# Altium schematic sheet PSU.SchDoc
size A; Author: duchuylee; DrawnBy: Duc Huy Le; SheetNumber: 2; SheetTotal: 4
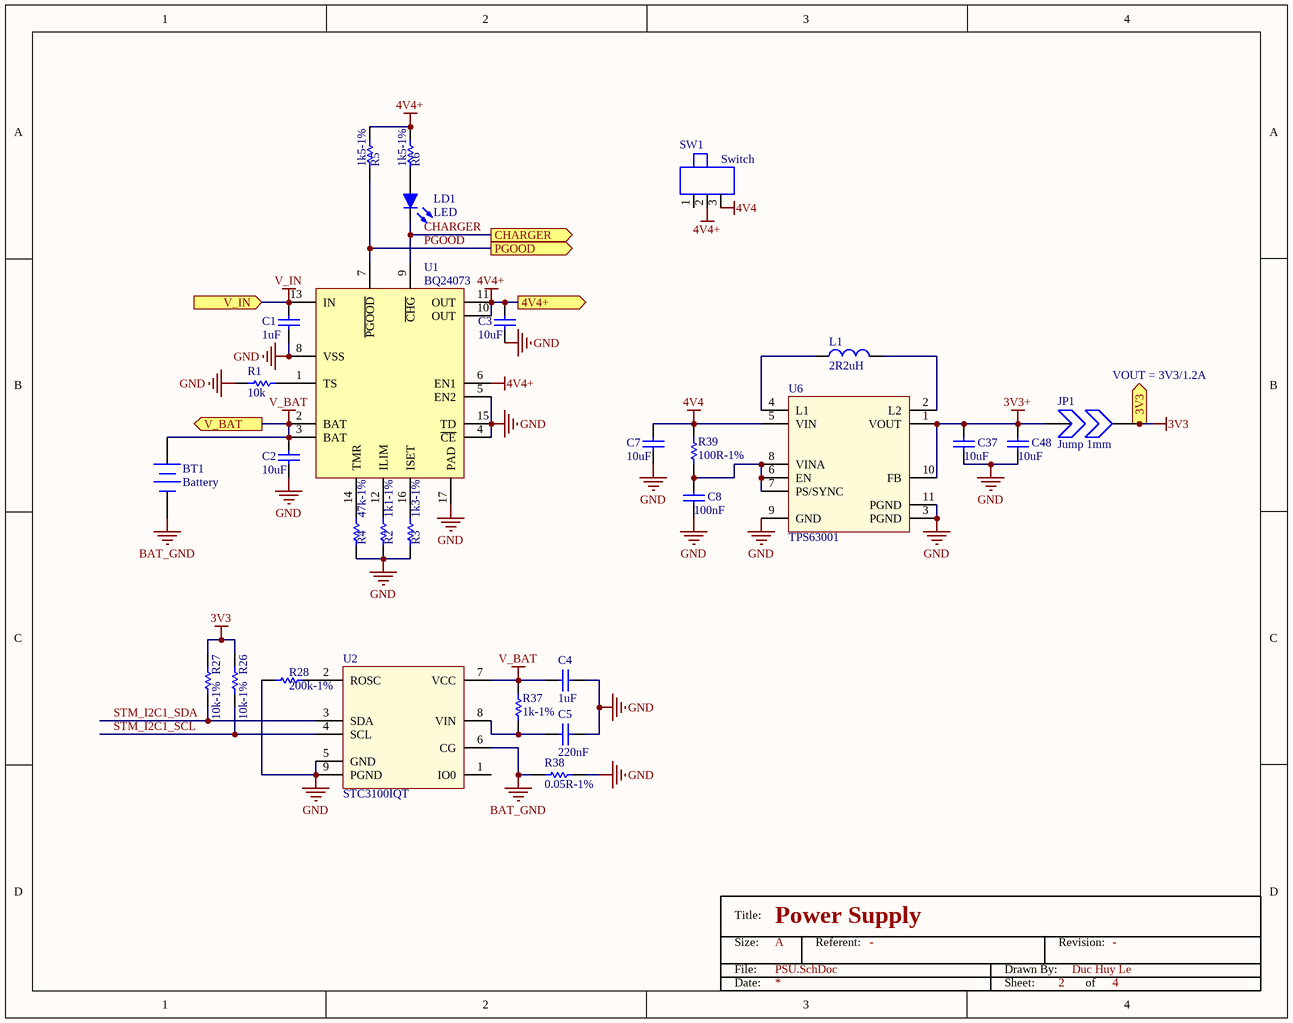
[diagram p0: PSU.SchDoc]

## Parts
BT1  Battery  [BAT-2]
C1  1uF  [Cap 0603]
C2  10uF  [Cap 0603]
C3  10uF  [Cap 0603]
C4  1uF  [Cap 0603]
C5  220nF  [Cap 0603]
C7  10uF  [Cap 0603]
C8  100nF  [Cap 0603]
C37  10uF  [Cap 0603]
C48  10uF  [Cap 0603]
JP1  Jump 1mm  [Jump 1mm]
L1  2R2uH  [Inductor 0520]
LD1  LED  [LED]
R1  10k  [Res 0603]
R2  1k1-1%  [Res 0603]
R3  1k3-1%  [Res 0603]
R4  47k-1%  [Res 0603]
R5  1k5-1%  [Res 0603]
R6  1k5-1%  [Res 0603]
R26  10k-1%  [Res 0603]
R27  10k-1%  [Res 0603]
R28  200k-1%  [Res 0603]
R37  1k-1%  [Res 0603]
R38  0.05R-1%  [Res 2512]
R39  100R-1%  [Res 0603]
SW1  Switch  [Slide switch MSK-38]
TitleBlock2  Title: Power Supply  Size: A  (hidden comment: Title Block)
U1  BQ24073  [QFN-16]
U2  STC3100IQT  [DFN-8 3x3]
U6  TPS63001  [VSON-10 3x3]

## Ports
3V3 (out), 4V4+ (out), CHARGER (out), PGOOD (out), V_BAT (out), V_IN (in)

## Nets
3V3: JP1.2 R26.1 R27.1 ; port 3V3
3V3+: C37.2 C48.2 JP1.1 U6.1(VOUT) U6.10(FB)
4V4: C7.2 R39.2 SW1.3(A3) U6.5(VIN)
4V4+: C3.2 R5.2 R6.2 SW1.2(A2) U1.6(EN1) U1.10(OUT) U1.11(OUT) ; port 4V4+
BAT_GND: BT1.2(-) R38.1 U2.6(CG)
GND: C1.1 C2.1 C3.1 C4.1 C5.1 C7.1 C8.1 C37.1 C48.1 R1.1 R2.1 R3.1 R4.1 R28.1 R38.2 U1.4(~{CE}) U1.5(EN2) U1.8(VSS) U1.15(TD) U1.17(PAD) U2.5(GND) U2.9(PGND) U6.3(PGND) U6.9(GND) U6.11(PGND)
V_BAT: BT1.1(+) C2.2 C4.2 R37.2 U1.2(BAT) U1.3(BAT) U2.7(VCC) ; port V_BAT
V_IN: C1.2 U1.13(IN) ; port V_IN
CHARGER: LD1.2(K) U1.9(~{CHG}) ; port CHARGER
PGOOD: R5.1 U1.7(~{PGOOD}) ; port PGOOD
STM_I2C1_SCL: R26.2 U2.4(SCL)
STM_I2C1_SDA: R27.2 U2.3(SDA)
NetC5_2: C5.2 R37.1 U2.8(VIN)
NetC8_2: C8.2 R39.1 U6.6(EN) U6.7(PS/SYNC) U6.8(VINA)
NetL1_1: L1.1 U6.4(L1)
NetL1_2: L1.2 U6.2(L2)
NetLD1_1: LD1.1(A) R6.1
NetR1_2: R1.2 U1.1(TS)
NetR2_2: R2.2 U1.12(ILIM)
NetR3_2: R3.2 U1.16(ISET)
NetR4_2: R4.2 U1.14(TMR)
NetR28_2: R28.2 U2.2(ROSC)

Not connected (* = marked no-connect by the designer): SW1 1(A1); U2 1(IO0)

## Notes on the sheet
- (near JP1) VOUT = 3V3/1.2A
- (in symbol Title Block) Title:; Size:; Referent:; Revision:; File:; Drawn By:; Date:; Sheet:; of

## Library data of the parts
BT1 = Battery: Multicell Battery; Published: 24-Mar-1999; LatestRevisionDate: 17-Jul-2002; LatestRevisionNote: Re-released for DXP Platform.; PackageReference: BAT-2; Publisher: Altium Limited; PackageDescription: Battery; 2 Leads
C1-C5 C7 C8 C37 C48 = Cap: Cap SMD
JP1 = Jump
L1 = Inductor: L- SMD
R1-R6 R26-R28 R37-R39 = Res: Res SMD
SW1 = SW 3: MSK-38 Slide switch 3 pin
U1 = BQ24073: Li-Ion Battery Charger
U2 = STC3100: Battery monitor IC with Coulomb counter/gas gauge
U6 = TPS63001: TPS6300x High-Efficient Single Inductor Buck-Boost Converter With 1.8-A Switches
LD1 = LED: Name: LED
TitleBlock2 = Title Block: Revision: -; Referent: -